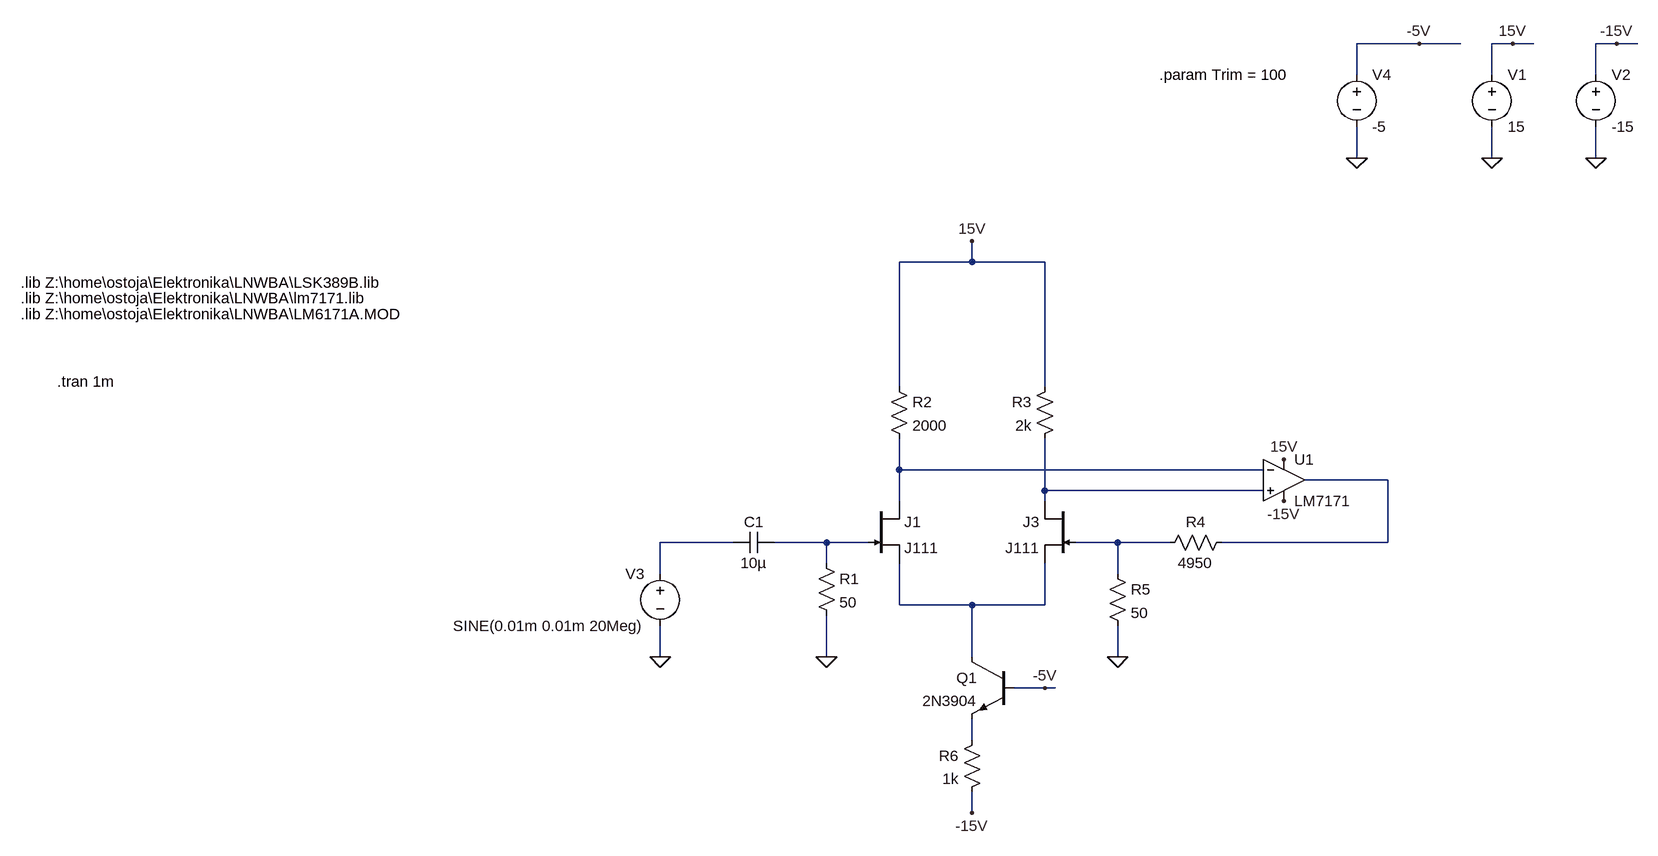
[diagram p0: schematic LNWBA_j111.asc]
LNWBA_j111.asc, the LTspice schematic file:
Version 4
SHEET 1 2516 804
WIRE 960 -592 864 -592
WIRE 1024 -592 960 -592
WIRE 1104 -592 1072 -592
WIRE 1136 -592 1104 -592
WIRE 1264 -592 1232 -592
WIRE 1296 -592 1264 -592
WIRE 864 -544 864 -592
WIRE 1072 -544 1072 -592
WIRE 1232 -544 1232 -592
WIRE 864 -416 864 -464
WIRE 1072 -416 1072 -464
WIRE 1232 -416 1232 -464
WIRE 272 -256 272 -288
WIRE 272 -256 160 -256
WIRE 384 -256 272 -256
WIRE 160 -64 160 -256
WIRE 384 -64 384 -256
WIRE 160 64 160 16
WIRE 720 64 160 64
WIRE 912 80 784 80
WIRE 384 96 384 16
WIRE 720 96 384 96
WIRE 160 112 160 64
WIRE 384 112 384 96
WIRE -96 176 -208 176
WIRE 48 176 -32 176
WIRE 112 176 48 176
WIRE 496 176 432 176
WIRE 576 176 496 176
WIRE 912 176 912 80
WIRE 912 176 656 176
WIRE 48 208 48 176
WIRE -208 224 -208 176
WIRE 496 224 496 176
WIRE 160 272 160 208
WIRE 272 272 160 272
WIRE 384 272 384 208
WIRE 384 272 272 272
WIRE -208 352 -208 304
WIRE 48 352 48 288
WIRE 272 352 272 272
WIRE 496 352 496 304
WIRE 384 400 336 400
WIRE 400 400 384 400
WIRE 272 480 272 448
WIRE 272 592 272 560
FLAG 1104 -592 15V
FLAG 1264 -592 -15V
FLAG 1232 -416 0
FLAG 1072 -416 0
FLAG 272 -288 15V
FLAG 272 592 -15V
FLAG -208 352 0
FLAG 752 48 15V
FLAG 752 112 -15V
FLAG 496 352 0
FLAG 384 400 -5V
FLAG 960 -592 -5V
FLAG 864 -416 0
FLAG 48 352 0
SYMBOL njf 112 112 R0
SYMATTR InstName J1
SYMATTR Value J111
SYMBOL voltage 1072 -560 R0
WINDOW 123 0 0 Left 0
WINDOW 39 0 0 Left 0
SYMATTR InstName V1
SYMATTR Value 15
SYMBOL voltage 1232 -560 R0
WINDOW 123 0 0 Left 0
WINDOW 39 0 0 Left 0
SYMATTR InstName V2
SYMATTR Value -15
SYMBOL voltage -208 208 M0
WINDOW 123 0 0 Left 0
WINDOW 39 0 0 Left 0
SYMATTR InstName V3
SYMATTR Value SINE(0.01m 0.01m 20Meg)
SYMBOL res 144 -80 R0
SYMATTR InstName R2
SYMATTR Value 2000
SYMBOL res 400 -80 M0
SYMATTR InstName R3
SYMATTR Value 2k
SYMBOL res 672 160 R90
WINDOW 0 0 56 VBottom 2
WINDOW 3 32 56 VTop 2
SYMATTR InstName R4
SYMATTR Value 4950
SYMBOL res 480 208 R0
SYMATTR InstName R5
SYMATTR Value 50
SYMBOL npn 336 352 M0
SYMATTR InstName Q1
SYMATTR Value 2N3904
SYMBOL voltage 864 -560 R0
WINDOW 123 0 0 Left 0
WINDOW 39 0 0 Left 0
SYMATTR InstName V4
SYMATTR Value -5
SYMBOL res 288 464 M0
SYMATTR InstName R6
SYMATTR Value 1k
SYMBOL OpAmps\\opamp2 752 16 R0
SYMATTR InstName U1
SYMATTR Value LM7171
SYMBOL cap -32 160 R90
WINDOW 0 0 32 VBottom 2
WINDOW 3 32 32 VTop 2
SYMATTR InstName C1
SYMATTR Value 10µ
SYMBOL res 32 192 R0
SYMATTR InstName R1
SYMATTR Value 50
SYMBOL njf 432 112 M0
SYMATTR InstName J3
SYMATTR Value J111
TEXT -1192 -224 Left 2 !.lib Z:\\home\\ostoja\\Elektronika\\LNWBA\\LSK389B.lib
TEXT -1136 -72 Left 2 !.tran 1m
TEXT -1192 -200 Left 2 !.lib Z:\\home\\ostoja\\Elektronika\\LNWBA\\lm7171.lib
TEXT -1192 -176 Left 2 !.lib Z:\\home\\ostoja\\Elektronika\\LNWBA\\LM6171A.MOD
TEXT 560 -544 Left 2 !.param Trim = 100

The netlist it stands for:
* LNWBA_j111.asc
J1 N001 N005 N007 J111
V1 15V 0 15
V2 -15V 0 -15
V3 N004 0 SINE(0.01m 0.01m 20Meg)
R2 15V N001 2000
R3 15V N003 2k
R4 N002 N006 4950
R5 N006 0 50
Q1 N007 -5V N008 0 2N3904
V4 -5V 0 -5
R6 N008 -15V 1k
XU1 N003 N001 15V -15V N002 LM7171  ; pins In+ In- V+ V- OUT
C1 N005 N004 10µ
R1 N005 0 50
J3 N003 N006 N007 J111
.model NPN NPN
.model PNP PNP
.lib standard.bjt
.model NJF NJF
.model PJF PJF
.lib standard.jft
.lib Z:\home\ostoja\Elektronika\LNWBA\LSK389B.lib
.tran 1m
.lib Z:\home\ostoja\Elektronika\LNWBA\lm7171.lib
.lib Z:\home\ostoja\Elektronika\LNWBA\LM6171A.MOD
.param Trim = 100
.backanno
.end